# Altium project shower.PrjPCB
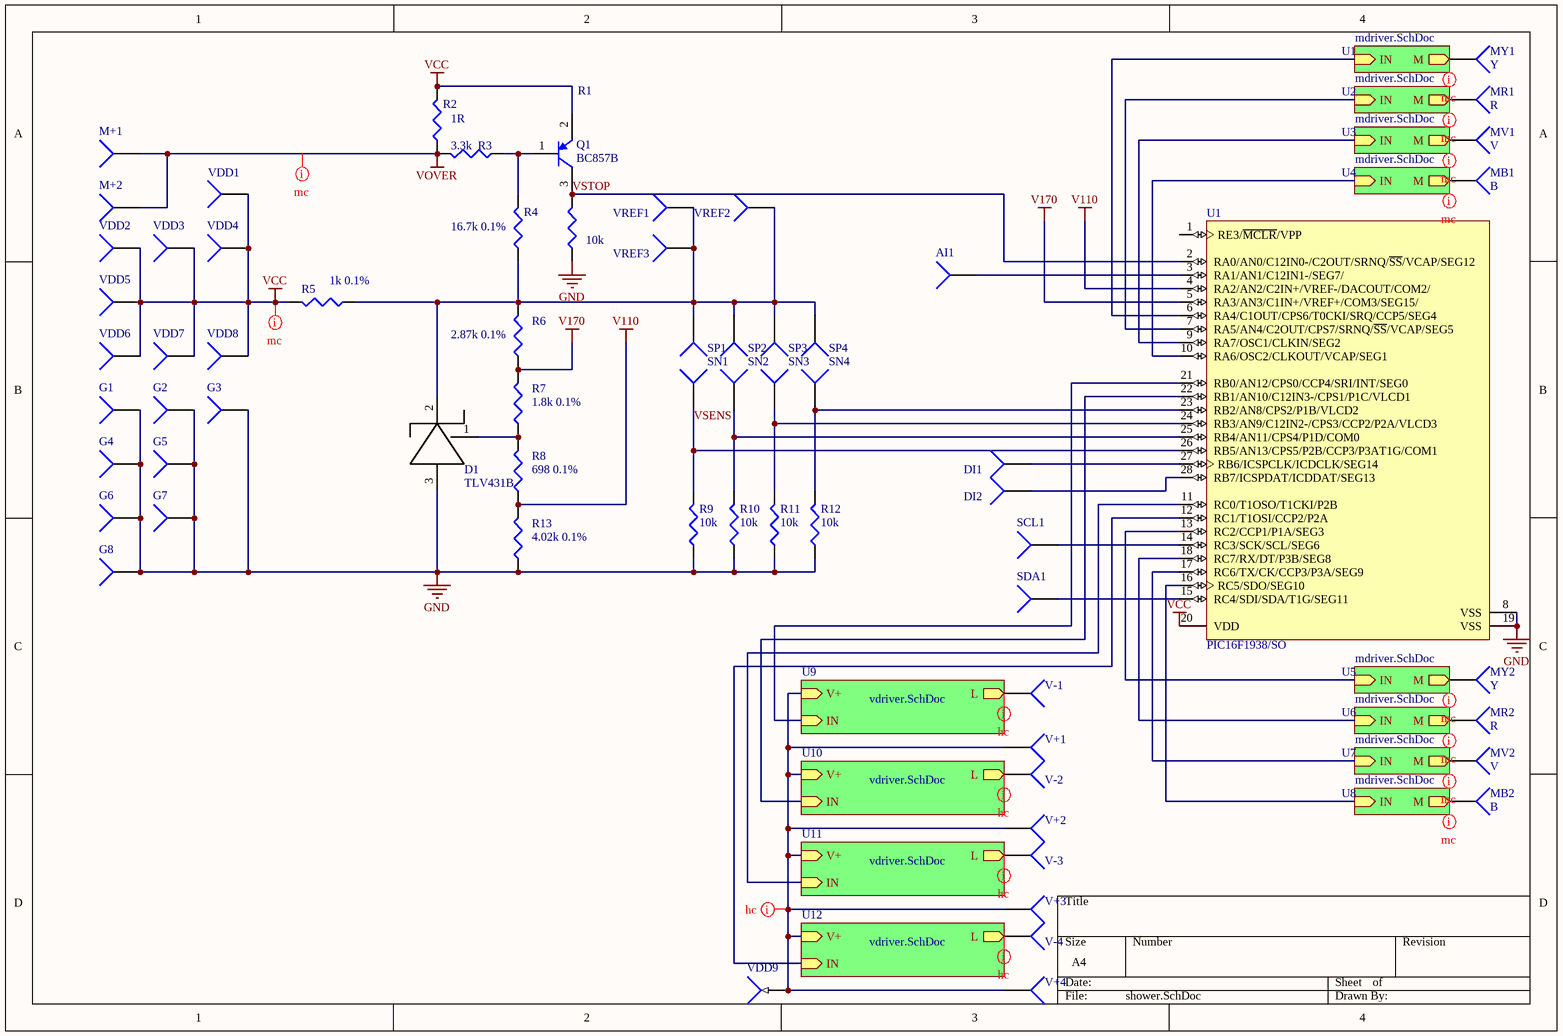
[diagram p0: shower.SchDoc]
3 sheets, 123 parts. Net scope: hierarchical (ports join the sheet entries above them; power ports are global).
Board file: shower.PcbDoc
Sheets:
  shower.SchDoc
    U1 = mdriver.SchDoc
    U2 = mdriver.SchDoc
    U3 = mdriver.SchDoc
    U4 = mdriver.SchDoc
    U5 = mdriver.SchDoc
    U6 = mdriver.SchDoc
    U7 = mdriver.SchDoc
    U8 = mdriver.SchDoc
    U10 = vdriver.SchDoc
    U11 = vdriver.SchDoc
    U12 = vdriver.SchDoc
    U9 = vdriver.SchDoc

## Sheet shower.SchDoc
size A4

### Parts
AI1  +5V  [PIN1]  (value not drawn)
D1  TLV431B  [SOT-23_N]
DI1  +5V  [PIN1]  (value not drawn)
DI2  +5V  [PIN1]  (value not drawn)
G1  Socket  [PIN1]  (value not drawn)
G2  Socket  [PIN1]  (value not drawn)
G3  Socket  [PIN1]  (value not drawn)
G4  Socket  [PIN1]  (value not drawn)
G5  Socket  [PIN1]  (value not drawn)
G6  Socket  [PIN1]  (value not drawn)
G7  Socket  [PIN1]  (value not drawn)
G8  Socket  [PIN1]  (value not drawn)
M+1  +5V  [PIN1]  (value not drawn)
M+2  +5V  [PIN1]  (value not drawn)
MB1  B  [PIN1]
MB2  B  [PIN1]
MR1  R  [PIN1]
MR2  R  [PIN1]
MV1  V  [PIN1]
MV2  V  [PIN1]
MY1  Y  [PIN1]
MY2  Y  [PIN1]
Q1  BC857B  [SOT-23_N]
R1  10k  [J1-0603]
R2  1R  [J1-0603]
R3  3.3k  [J1-0603]
R4  16.7k 0.1%  [J1-0603]
R5  1k 0.1%  [J1-0603]
R6  2.87k 0.1%  [J1-0603]
R7  1.8k 0.1%  [J1-0603]
R8  698 0.1%  [J1-0603]
R9  10k  [J1-0603]
R10  10k  [J1-0603]
R11  10k  [J1-0603]
R12  10k  [J1-0603]
R13  4.02k 0.1%  [J1-0603]
SCL1  +5V  [PIN1]  (value not drawn)
SDA1  +5V  [PIN1]  (value not drawn)
SN1  +5V  [PIN1]  (value not drawn)
SN2  +5V  [PIN1]  (value not drawn)
SN3  +5V  [PIN1]  (value not drawn)
SN4  +5V  [PIN1]  (value not drawn)
SP1  +5V  [PIN1]  (value not drawn)
SP2  +5V  [PIN1]  (value not drawn)
SP3  +5V  [PIN1]  (value not drawn)
SP4  +5V  [PIN1]  (value not drawn)
U1  PIC16F1938/SO  [SOIC-SO28_N]
V+1  +5V  [PIN1]  (value not drawn)
V+2  +5V  [PIN1]  (value not drawn)
V+3  +5V  [PIN1]  (value not drawn)
V+4  +5V  [PIN1]  (value not drawn)
V-1  +5V  [PIN1]  (value not drawn)
V-2  +5V  [PIN1]  (value not drawn)
V-3  +5V  [PIN1]  (value not drawn)
V-4  +5V  [PIN1]  (value not drawn)
VDD1  +5V  [PIN1]  (value not drawn)
VDD2  +5V  [PIN1]  (value not drawn)
VDD3  +5V  [PIN1]  (value not drawn)
VDD4  +5V  [PIN1]  (value not drawn)
VDD5  +5V  [PIN1]  (value not drawn)
VDD6  +5V  [PIN1]  (value not drawn)
VDD7  +5V  [PIN1]  (value not drawn)
VDD8  +5V  [PIN1]  (value not drawn)
VDD9  +5V  [PIN1]  (value not drawn)
VREF1  +5V  [PIN1]  (value not drawn)
VREF2  +5V  [PIN1]  (value not drawn)
VREF3  +5V  [PIN1]  (value not drawn)

### Sub-sheets
U1 = mdriver.SchDoc: IN (in), M (out)
U2 = mdriver.SchDoc: IN (in), M (out)
U3 = mdriver.SchDoc: IN (in), M (out)
U4 = mdriver.SchDoc: IN (in), M (out)
U5 = mdriver.SchDoc: IN (in), M (out)
U6 = mdriver.SchDoc: IN (in), M (out)
U7 = mdriver.SchDoc: IN (in), M (out)
U8 = mdriver.SchDoc: IN (in), M (out)
U9 = vdriver.SchDoc: IN (in), V+ (in), L (out)
U10 = vdriver.SchDoc: IN (in), V+ (in), L (out)
U11 = vdriver.SchDoc: IN (in), V+ (in), L (out)
U12 = vdriver.SchDoc: IN (in), V+ (in), L (out)

### Nets
GND: D1.3 G1.1 G2.1 G3.1 G4.1 G5.1 G6.1 G7.1 G8.1 R1.1 R9.1 R10.1 R11.1 R12.1 R13.1 U1.8(VSS) U1.19(VSS)
V110: R8.1 R13.2 U1.4(RA2/AN2/C2IN+/VREF-/DACOUT/COM2/)
V170: R6.1 R7.2 U1.5(RA3/AN3/C1IN+/VREF+/COM3/SEG15/)
VCC: Q1.2(E) R2.2 R5.2 U1.20(VDD) VDD1.1 VDD2.1 VDD3.1 VDD4.1 VDD5.1 VDD6.1 VDD7.1 VDD8.1
VOVER: M+1.1 M+2.1 R2.1 R3.2
VSENS: R9.2 SN1.1 U1.26(RB5/AN13/CPS5/P2B/CCP3/P3AT1G/COM1)
VSTOP: Q1.3(C) R1.2 U1.2(RA0/AN0/C12IN0-/C2OUT/SRNQ/~{SS}/VCAP/SEG12)
NetAI1_1: AI1.1 U1.3(RA1/AN1/C12IN1-/SEG7/)
NetD1_1: D1.1 R7.1 R8.2
NetD1_2: D1.2 R4.1 R5.1 R6.2 SP1.1 SP2.1 SP3.1 SP4.1 VREF1.1 VREF2.1 VREF3.1
NetD2#1_1: MY1.1 ; sheet U1/M
NetD2#2_1: MR1.1 ; sheet U2/M
NetD2#3_1: MV1.1 ; sheet U3/M
NetD2#4_1: MB1.1 ; sheet U4/M
NetD2#5_1: MY2.1 ; sheet U5/M
NetD2#6_1: MR2.1 ; sheet U6/M
NetD2#7_1: MV2.1 ; sheet U7/M
NetD2#8_1: MB2.1 ; sheet U8/M
NetDI1_1: DI1.1 U1.27(RB6/ICSPCLK/ICDCLK/SEG14)
NetDI2_1: DI2.1 U1.28(RB7/ICSPDAT/ICDDAT/SEG13)
NetQ1_1: Q1.1(B) R3.1 R4.2
NetR10_2: R10.2 SN2.1 U1.25(RB4/AN11/CPS4/P1D/COM0)
NetR11_2: R11.2 SN3.1 U1.24(RB3/AN9/C12IN2-/CPS3/CCP2/P2A/VLCD3)
NetR12_2: R12.2 SN4.1 U1.23(RB2/AN8/CPS2/P1B/VLCD2)
NetR15#1_1: V+1.1 V+2.1 V+3.1 V+4.1 VDD9.1 ; sheet U10/V+, sheet U11/V+, sheet U12/V+, sheet U9/V+
NetR18#1_1: U1.6(RA4/C1OUT/CPS6/T0CKI/SRQ/CCP5/SEG4) ; sheet U1/IN
NetR18#2_1: U1.7(RA5/AN4/C2OUT/CPS7/SRNQ/~{SS}/VCAP/SEG5) ; sheet U2/IN
NetR18#3_1: U1.9(RA7/OSC1/CLKIN/SEG2) ; sheet U3/IN
NetR18#4_1: U1.10(RA6/OSC2/CLKOUT/VCAP/SEG1) ; sheet U4/IN
NetR18#5_1: U1.13(RC2/CCP1/P1A/SEG3) ; sheet U5/IN
NetR18#6_1: U1.18(RC7/RX/DT/P3B/SEG8) ; sheet U6/IN
NetR18#7_1: U1.17(RC6/TX/CK/CCP3/P3A/SEG9) ; sheet U7/IN
NetR18#8_1: U1.16(RC5/SDO/SEG10) ; sheet U8/IN
NetR19#1_1: U1.22(RB1/AN10/C12IN3-/CPS1/P1C/VLCD1) ; sheet U10/IN
NetR19#2_1: U1.11(RC0/T1OSO/T1CKI/P2B) ; sheet U11/IN
NetR19#3_1: U1.12(RC1/T1OSI/CCP2/P2A) ; sheet U12/IN
NetR19#4_1: U1.21(RB0/AN12/CPS0/CCP4/SRI/INT/SEG0) ; sheet U9/IN
NetSCL1_1: SCL1.1 U1.14(RC3/SCK/SCL/SEG6)
NetSDA1_1: SDA1.1 U1.15(RC4/SDI/SDA/T1G/SEG11)
NetU2#1_1: V-2.1 ; sheet U10/L
NetU2#2_1: V-3.1 ; sheet U11/L
NetU2#3_1: V-4.1 ; sheet U12/L
NetU2#4_1: V-1.1 ; sheet U9/L

Not connected (* = marked no-connect by the designer): U1 1(RE3/~{MCLR}/VPP)

### Layout directives
net class hc: NetR15#1_1, NetU2#1_1, NetU2#2_1, NetU2#3_1, NetU2#4_1
net class mc: NetD2#1_1, NetD2#2_1, NetD2#3_1, NetD2#4_1, NetD2#5_1, NetD2#6_1, NetD2#7_1, NetD2#8_1, VCC, VOVER

### Library data of the parts
AI1 DI1 DI2 M+1 M+2 MB1 MB2 MR1 MR2 MV1 MV2 MY1 MY2 SCL1 SDA1 SN1-SN4 SP1-SP4 V+1-V+4 V-1-V-4 VDD1-VDD9 VREF1-VREF3 = Socket: LatestRevisionDate: 17-Jul-2002; LatestRevisionNote: Re-released for DXP Platform.; Publisher: Altium Limited
D1 = TLV431A
Q1 = PNP: PNP Bipolar Transistor; Published: 8-Jun-2000; LatestRevisionDate: 29-May-2009; LatestRevisionNote: IPC-7351 Footprint Added.; PackageVersion: Aug-1999; PackageReference: SOT-23B; Publisher: Altium Limited; PackageDescription: 3-Pin SOT-23 Package 0.95 mm Pitch, 2.4 mm Lead Span
R1 R3-R7 R9-R13 = Res3: Resistor; Published: 8-Jun-2000; LatestRevisionDate: 29-May-2009; LatestRevisionNote: IPC-7351 Footprint Added.; PackageReference: J1-0603; Publisher: Altium Limited; PackageDescription: Chip Resistor
  R1 R9-R12: Value: 10K
  R3: Value: 3.3K
  R4: Value: 16.7k
  R5: Value: 1k
  R6: Value: 2.87K
  R7: Value: 1.8k
  R13: Value: 4.02K
R2 = Res3: Resistor; Value: 1; Published: 8-Jun-2000; LatestRevisionDate: 29-May-2009; LatestRevisionNote: IPC-7351 Footprint Added.; PackageReference: J1-0603; Publisher: Altium Limited; PackageDescription: Chip Resistor
R8 = Res3: Resistor; Value: 698; Published: 8-Jun-2000; LatestRevisionDate: 29-May-2009; LatestRevisionNote: IPC-7351 Footprint Added.; PackageReference: J1-0603; Publisher: Altium Limited; PackageDescription: Chip Resistor
U1 = PIC16F1936T-I/SO: CMOS Microcontroller with LCD Driver, 8K (words) Program Memory, 256 Bytes Data Memory, 512 Bytes SRAM, 25 I/O's, 28-Pin SOIC, Industrial Temperature, Tape and Reel; Published: 40149; LatestRevisionDate: 11-Aug-2010; LatestRevisionNote: Sch. layout revised.; DatasheetVersion: revC, Sep-2009; PackageVersion: revBB, Aug-2009; PackageReference: SOIC-SO28; Publisher: Altium Limited; PackageDescription: 28-Lead Plastic Small Outline (SO) - Wide 7.50mm Body [SOIC]; Supplier 1: Digi-Key; Supplier Part Number 1: PIC16F1936T-I/SO-ND; Code_JEDEC: MS-013; ComponentLink1Description: Datasheet; ComponentLink1URL: http://ww1.microchip.com/downloads/en/DeviceDoc/41364C.pdf; ComponentLink2Description: Packaging Specification; ComponentLink2URL: http://www.microchip.com/stellent/groups/techpub_sg/documents/packagingspec/en012702.pdf; ComponentLink3Description: Microchip.com Home; ComponentLink3URL: http://www.microchip.com/
G1-G8 = Socket: LatestRevisionDate: 17-Jul-2002; LatestRevisionNote: Re-released for DXP Platform.; Publisher: Altium Limited

## Sheet mdriver.SchDoc
size A4
Used 8 times, as channels U1, U2, U3, U4, U5, U6, U7, U8. Parts and nets are listed once, with the designators drawn on the sheet.
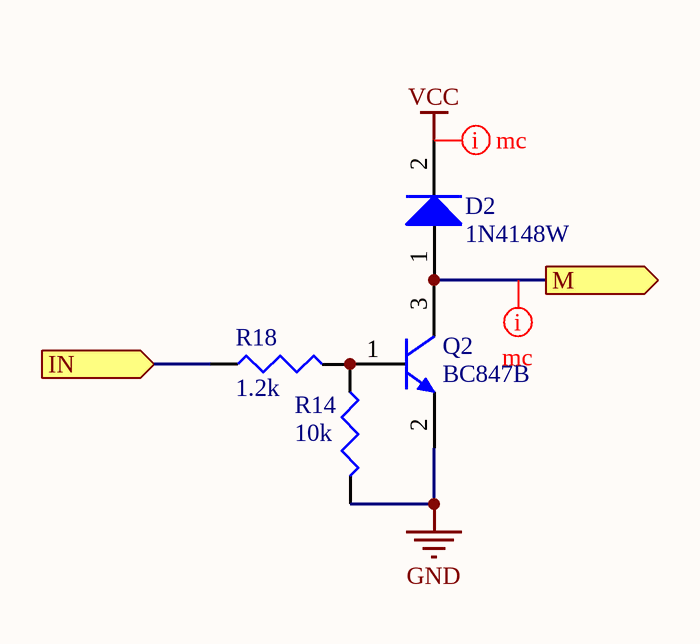
[diagram p1: mdriver.SchDoc]

### Parts
D2  1N4148W  [SOD-123]
Q2  BC847B  [SOT-23_N]
R14  10k  [J1-0603]
R18  1.2k  [J1-0603]

### Ports
IN (in), M (out)

### Nets
GND: Q2.2(E) R14.2
VCC: D2.2(K)
IN: R18.1 ; port IN
M: D2.1(A) Q2.3(C) ; port M
NetQ2_1: Q2.1(B) R14.1 R18.2

### Channels
U1: designators end in #1; ports IN=NetR18#1_1 M=NetD2#1_1
U2: designators end in #2; ports IN=NetR18#2_1 M=NetD2#2_1
U3: designators end in #3; ports IN=NetR18#3_1 M=NetD2#3_1
U4: designators end in #4; ports IN=NetR18#4_1 M=NetD2#4_1
U5: designators end in #5; ports IN=NetR18#5_1 M=NetD2#5_1
U6: designators end in #6; ports IN=NetR18#6_1 M=NetD2#6_1
U7: designators end in #7; ports IN=NetR18#7_1 M=NetD2#7_1
U8: designators end in #8; ports IN=NetR18#8_1 M=NetD2#8_1

### Layout directives
net class mc: NetD2#1_1, VCC

### Library data of the parts
D2 = Diode: Default Diode; Published: 8-Jun-2000; LatestRevisionDate: 17-Jul-2002; LatestRevisionNote: Re-released for DXP Platform.; PackageVersion: Sep-1996; PackageReference: SMC; Publisher: Altium Limited; PackageDescription: DO-214-AB/SMC; 2 C-Bend Leads; Body 7.9 x 5.9 mm, inc. leads (LxW); Code_JEDEC: DO-214-AB
Q2 = NPN: NPN Bipolar Transistor; Published: 8-Jun-2000; LatestRevisionDate: 17-Jul-2002; LatestRevisionNote: Re-released for DXP Platform.; PackageReference: TO-226-AA; Publisher: Altium Limited; PackageDescription: TO, Flat Index; 3 In-Line, Axial Leads; Body Dia. 4.8mm; Leads 0.55 x 0.51 mm (max); Code_JEDEC: TO-226-AA
R14 R18 = Res3: Resistor; Published: 8-Jun-2000; LatestRevisionDate: 29-May-2009; LatestRevisionNote: IPC-7351 Footprint Added.; PackageReference: J1-0603; Publisher: Altium Limited; PackageDescription: Chip Resistor
  R14: Value: 10K
  R18: Value: 1.2K

## Sheet vdriver.SchDoc
size A4
Used 4 times, as channels U10, U11, U12, U9. Parts and nets are listed once, with the designators drawn on the sheet.
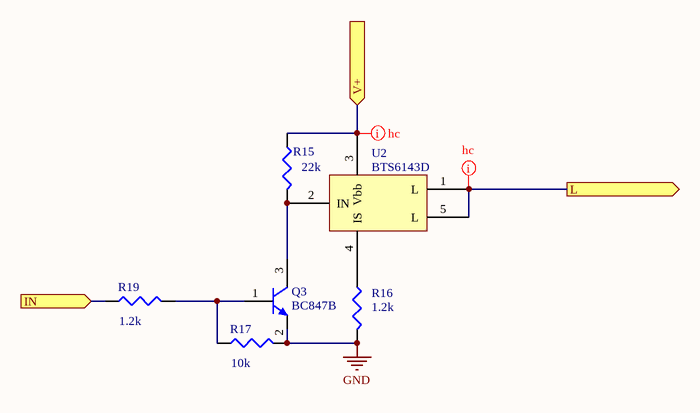
[diagram p2: vdriver.SchDoc]

### Parts
Q3  BC847B  [SOT-23_N]
R15  22k  [J1-0603]
R16  1.2k  [J1-0603]
R17  10k  [J1-0603]
R19  1.2k  [J1-0603]
U2  BTS6143D  [BTS6143D]

### Ports
IN (in), L (out), V+ (in)

### Nets
GND: Q3.2(E) R16.2 R17.2
IN: R19.1 ; port IN
L: U2.1(L) U2.5(L) ; port L
V+: R15.1 U2.3(Vbb) ; port V+
NetQ3_1: Q3.1(B) R17.1 R19.2
NetQ3_3: Q3.3(C) R15.2 U2.2(IN)
NetR16_1: R16.1 U2.4(IS)

### Channels
U10: designators end in #1; ports IN=NetR19#1_1 L=NetU2#1_1 V+=NetR15#1_1
U11: designators end in #2; ports IN=NetR19#2_1 L=NetU2#2_1 V+=NetR15#1_1
U12: designators end in #3; ports IN=NetR19#3_1 L=NetU2#3_1 V+=NetR15#1_1
U9: designators end in #4; ports IN=NetR19#4_1 L=NetU2#4_1 V+=NetR15#1_1

### Layout directives
net class hc: NetR15#1_1, NetU2#1_1

### Library data of the parts
Q3 = NPN: NPN Bipolar Transistor; Published: 8-Jun-2000; LatestRevisionDate: 17-Jul-2002; LatestRevisionNote: Re-released for DXP Platform.; PackageReference: TO-226-AA; Publisher: Altium Limited; PackageDescription: TO, Flat Index; 3 In-Line, Axial Leads; Body Dia. 4.8mm; Leads 0.55 x 0.51 mm (max); Code_JEDEC: TO-226-AA
R15-R17 = Res3: Resistor; Published: 8-Jun-2000; LatestRevisionDate: 29-May-2009; LatestRevisionNote: IPC-7351 Footprint Added.; PackageReference: J1-0603; Publisher: Altium Limited; PackageDescription: Chip Resistor
  R15: Value: 22K
  R16: Value: 1.2K
  R17: Value: 10K
R19 = Res3: Resistor; Value: 10K; Published: 8-Jun-2000; LatestRevisionDate: 29-May-2009; LatestRevisionNote: IPC-7351 Footprint Added.; PackageReference: J1-0603; Publisher: Altium Limited; PackageDescription: Chip Resistor

## Nets that join several sheets
GND: shower (17 pins), U1 (Q2#1.2 R14#1.2), U2 (Q2#2.2 R14#2.2), U3 (Q2#3.2 R14#3.2), U4 (Q2#4.2 R14#4.2), U5 (Q2#5.2 R14#5.2), U6 (Q2#6.2 R14#6.2), U7 (Q2#7.2 R14#7.2), U8 (Q2#8.2 R14#8.2), U10 (Q3#1.2 R16#1.2 R17#1.2), U11 (Q3#2.2 R16#2.2 R17#2.2), U12 (Q3#3.2 R16#3.2 R17#3.2), U9 (Q3#4.2 R16#4.2 R17#4.2)
VCC: shower (12 pins), U1 (D2#1.2), U2 (D2#2.2), U3 (D2#3.2), U4 (D2#4.2), U5 (D2#5.2), U6 (D2#6.2), U7 (D2#7.2), U8 (D2#8.2)
NetD2#1_1: shower (MY1.1), U1 (D2#1.1 Q2#1.3)
NetD2#2_1: shower (MR1.1), U2 (D2#2.1 Q2#2.3)
NetD2#3_1: shower (MV1.1), U3 (D2#3.1 Q2#3.3)
NetD2#4_1: shower (MB1.1), U4 (D2#4.1 Q2#4.3)
NetD2#5_1: shower (MY2.1), U5 (D2#5.1 Q2#5.3)
NetD2#6_1: shower (MR2.1), U6 (D2#6.1 Q2#6.3)
NetD2#7_1: shower (MV2.1), U7 (D2#7.1 Q2#7.3)
NetD2#8_1: shower (MB2.1), U8 (D2#8.1 Q2#8.3)
NetR15#1_1: shower (5 pins), U10 (R15#1.1 U2#1.3), U11 (R15#2.1 U2#2.3), U12 (R15#3.1 U2#3.3), U9 (R15#4.1 U2#4.3)
NetR18#1_1: shower (U1.6), U1 (R18#1.1)
NetR18#2_1: shower (U1.7), U2 (R18#2.1)
NetR18#3_1: shower (U1.9), U3 (R18#3.1)
NetR18#4_1: shower (U1.10), U4 (R18#4.1)
NetR18#5_1: shower (U1.13), U5 (R18#5.1)
NetR18#6_1: shower (U1.18), U6 (R18#6.1)
NetR18#7_1: shower (U1.17), U7 (R18#7.1)
NetR18#8_1: shower (U1.16), U8 (R18#8.1)
NetR19#1_1: shower (U1.22), U10 (R19#1.1)
NetR19#2_1: shower (U1.11), U11 (R19#2.1)
NetR19#3_1: shower (U1.12), U12 (R19#3.1)
NetR19#4_1: shower (U1.21), U9 (R19#4.1)
NetU2#1_1: shower (V-2.1), U10 (U2#1.1 U2#1.5)
NetU2#2_1: shower (V-3.1), U11 (U2#2.1 U2#2.5)
NetU2#3_1: shower (V-4.1), U12 (U2#3.1 U2#3.5)
NetU2#4_1: shower (V-1.1), U9 (U2#4.1 U2#4.5)